# EAGLE design mainboard_v2.1 (EAGLE 6.3)
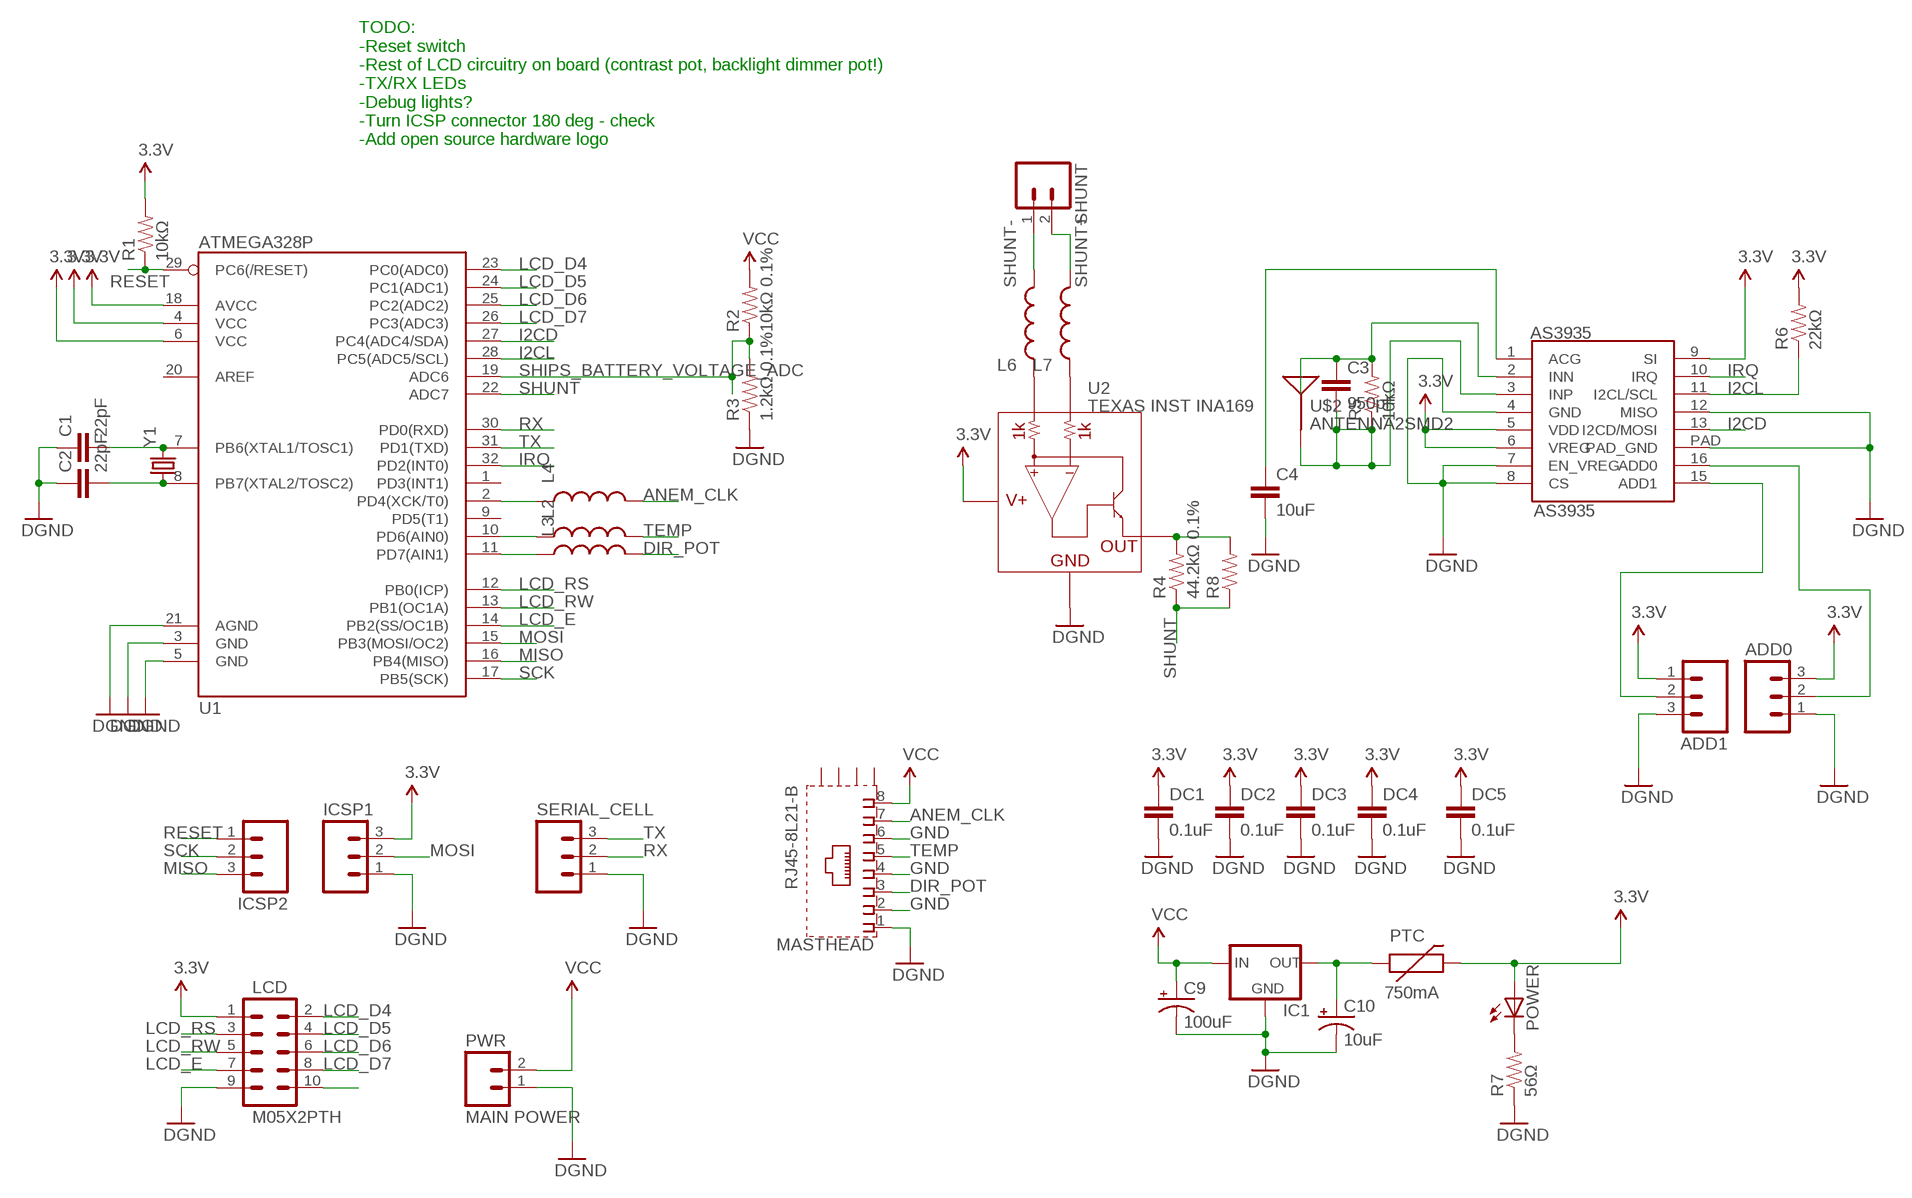
[diagram p0: schematic, sheet 1]

## Parts
ADD0  M03LOCK  [1X03_LOCK]
ADD1  M03LOCK  [1X03_LOCK]
AS3935  AS3935  [16LDMLPQ]
C1  22pF  CAP0805  [0805]
C2  22pF  CAP0805  [0805]
C3  950pF  CAP0805  [0805]
C4  10uF  CAP0805  [0805]
C9  100uF  CAP_POLPTH4  [CPOL-RADIAL-1000UF-25V]
C10  10uF  CAP_POLPTH2  [CPOL-RADIAL-10UF-25V]
DC1  0.1uF  CAP0805  [0805]
DC2  0.1uF  CAP0805  [0805]
DC3  0.1uF  CAP0805  [0805]
DC4  0.1uF  CAP0805  [0805]
DC5  0.1uF  CAP0805  [0805]
IC1  V_REG_78XXSINK  [TO220-IGO]
ICSP1  M03PTH  [1X03]
ICSP2  M03PTH  [1X03]
L2  INDUCTOR0805  [0805]
L3  INDUCTOR0805  [0805]
L4  INDUCTOR0805  [0805]
L6  INDUCTOR0805  [0805]
L7  INDUCTOR0805  [0805]
LCD  M05X2PTH  [AVR_ICSP]
MASTHEAD  RJ45-8L21-B  [RJ45-SHIELD1]
POWER  LED1206  [LED-1206]
PTC  750mA  PTCSMD  [PTC-1206]
PWR  MAIN POWER  M02-JST-2-PTH-NO_SILK  [JST-2-PTH-NS]
R1  10kΩ  RESISTOR0805-RES  [0805]
R2  10kΩ 0.1%  RESISTOR0805-RES  [0805]
R3  1.2kΩ 0.1%  RESISTOR0805-RES  [0805]
R4  44.2kΩ 0.1%  RESISTOR0805-RES  [0805]
R5  10kΩ  RESISTOR0805-RES  [0805]
R6  22kΩ  RESISTOR0805-RES  [0805]
R7  56Ω  RESISTOR0805-RES  [0805]
R8  RESISTOR0402-RES  [0402-RES]
SERIAL_CELL  M03LOCK  [1X03_LOCK]
SHUNT  M02LOCK  [1X02_LOCK]
U1  ATMEGA328P  ATMEGA328_SMT  [TQFP32-08]
U2  TEXAS INST INA169  INA139  [SOT23-5]
U$2  ANTENNA2SMD2  [ANTENNA-CHIP3]
Y1  CRYSTALTXC-7A  [CRYSTAL-TXC-7A]

## Nets
3.3V: ADD0.3 ADD1.1 AS3935.5(VDD) AS3935.6(VREG) AS3935.9(SI) DC1.1 DC2.1 DC3.1 DC4.1 DC5.1 ICSP1.3 LCD.1 POWER.A PTC.2 R1.2 R6.2 U1.4(VCC) U1.6(VCC) U1.18(AVCC) U2.5(V+)
ADD0: ADD0.2 AS3935.16(ADD0)
ADD1: ADD1.2 AS3935.15(ADD1)
ANEM_CLK: L4.2 MASTHEAD.7
AS3935_INN: AS3935.2(INN) C3.1 R5.2
AS3935_INP: AS3935.3(INP) C3.2 R5.1 U$2.FEED(SIGNAL)
DIR_POT: L3.2 MASTHEAD.3
GND: ADD0.1 ADD1.3 AS3935.4(GND) AS3935.7(EN_VREG) AS3935.8(CS) AS3935.12(MISO) AS3935.PAD(PAD_GND) C1.1 C2.1 C4.2 C9.2(-) C10.2(-) DC1.2 DC2.2 DC3.2 DC4.2 DC5.2 IC1.GND ICSP1.1 LCD.9 MASTHEAD.1 MASTHEAD.2 MASTHEAD.4 MASTHEAD.6 PWR.1 R3.1 R7.1 SERIAL_CELL.1 U1.3(GND) U1.5(GND) U1.21(AGND) U2.2(GND) ; supply symbol labelled DGND
I2CD: AS3935.13(I2CD/MOSI) U1.27(PC4(ADC4/SDA))
I2CL: AS3935.11(I2CL/SCL) R6.1 U1.28(PC5(ADC5/SCL))
IRQ: AS3935.10(IRQ) U1.32(PD2(INT0))
LCD_D4: LCD.2 U1.23(PC0(ADC0))
LCD_D5: LCD.4 U1.24(PC1(ADC1))
LCD_D6: LCD.6 U1.25(PC2(ADC2))
LCD_D7: LCD.8 U1.26(PC3(ADC3))
LCD_E: LCD.7 U1.14(PB2(SS/OC1B))
LCD_RS: LCD.3 U1.12(PB0(ICP))
LCD_RW: LCD.5 U1.13(PB1(OC1A))
MISO: ICSP2.3 U1.16(PB4(MISO))
MOSI: ICSP1.2 U1.15(PB3(MOSI/OC2))
N$6: AS3935.1(ACG) C4.1
N$7: L3.1 U1.11(PD7(AIN1))
N$8: L2.1 U1.10(PD6(AIN0))
N$9: L4.1 U1.2(PD4(XCK/T0))
N$10: L6.1 U2.3(VIN+)
N$11: L7.1 U2.4(VIN-)
N$12: R4.2 R8.2 U2.1(OUT)
N$13: LCD.10
N$16: POWER.C R7.2
RESET: ICSP2.1 R1.1 U1.29(PC6(/RESET))
RX: SERIAL_CELL.2 U1.30(PD0(RXD))
SCK: ICSP2.2 U1.17(PB5(SCK))
SHIPS_BATTERY_VOLTAGE_ADC: R2.1 R3.2 U1.19(ADC6)
SHUNT: R4.1 R8.1 U1.22(ADC7)
SHUNT+: L7.2 SHUNT.2
SHUNT-: L6.2 SHUNT.1
TEMP: L2.2 MASTHEAD.5
TX: SERIAL_CELL.3 U1.31(PD1(TXD))
VCC: C9.1(+) IC1.IN MASTHEAD.8 PWR.2 R2.2
VREG_OUT: C10.1(+) IC1.OUT PTC.1
XTAL1: C1.2 U1.7(PB6(XTAL1/TOSC1)) Y1.P$2
XTAL2: C2.2 U1.8(PB7(XTAL2/TOSC2)) Y1.P$1
Unconnected: MASTHEAD.S1(S) MASTHEAD.S2(S) MASTHEAD.S3(S) MASTHEAD.S4(S) U1.1(PD3(INT1)) U1.9(PD5(T1)) U1.20(AREF)

## Notes on the sheet
- TODO:
  -Reset switch
  -Rest of LCD circuitry on board (contrast pot, backlight dimmer pot!)
  -TX/RX LEDs
  -Debug lights?
  -Turn ICSP connector 180 deg - check
  -Add open source hardware logo

## Library data of the parts
ADD0 ADD1 ICSP1 ICSP2 SERIAL_CELL = SparkFun-Connectors:M03: Header 3 Standard 3-pin 0.1" header. Use with straight break away headers (SKU : PRT-00116), right angle break away headers (PRT-00553), swiss pins (PRT-00743), machine pins (PRT-00117), and female headers (PRT-00115). Molex polarized connector foot print use with SKU : PRT-08232 with associated crimp pins and housings.
AS3935 = buds-parts:AS3935
C1-C4 DC1-DC5 = SparkFun-Capacitors:CAP: Capacitor Standard 0603 ceramic capacitor, and 0.1" leaded capacitor.
C9 C10 = SparkFun-Capacitors:CAP_POL: Capacitor Polarized These are standard SMD and PTH capacitors. Normally 10uF, 47uF, and 100uF in electrolytic and tantalum varieties. Always verify the external diameter of the through hole cap, it varies with capacity, voltage, and manufacturer. The EIA devices should be standard.
IC1 = SparkFun-PowerIC:V_REG_78XX: Voltage Regulator Standard 7805 5V regulator. IGO (Input Ground Output). Spark Fun Electronics SKU : COM-00107
L2-L4 L6 L7 = SparkFun-Passives:INDUCTOR: Inductors Basic Inductor/Choke - 0603 and 1206. Footprints are not proven and vary greatly between part numbers.
LCD = SparkFun-Connectors:M05X2: Header 5x2 Standard 10-pin dual row 0.1" header. Commonly used with AVR-ISP. Use with Spark Fun Electronics SKU: PRT-00778
MASTHEAD = con-tycoelectronics:RJ45*2: RJ45 Low Profile Shield Type 2 For all RJ45 L, LC, LCT and X Series Models Source: www.tycoelectronics.com .. ENG_DS_1654001_1099_RJ_L_0507.pdf; OC_FARNELL: unknown; OC_NEWARK: unknown
POWER = SparkFun-LED:LED: LEDs Standard schematic elements and footprints for 5mm, 3mm, 1206, and 0603 sized LEDs. 5mm - Spark Fun Electronics SKU : COM-00529 (and others)
PTC = SparkFun-PowerIC:PTC: Resettable Fuse PTC Resettable Fuse. Spark Fun Electronics SKU : COM-08357
PWR SHUNT = SparkFun-Connectors:M02: Header 2 Standard 2-pin 0.1" header. Use with straight break away headers (SKU : PRT-00116), right angle break away headers (PRT-00553), swiss pins (PRT-00743), machine pins (PRT-00117), and female headers (PRT-00115). Molex polarized connector foot print use with SKU : PRT-08233 with associated crimp pins and housings.
R1-R8 = SparkFun-Resistors:RESISTOR: Resistor Basic schematic elements and footprints for 0603, 1206, and PTH resistors.
U1 = SparkFun-DigitalIC:ATMEGA328_SMT: 32-Pin Atmega328 part Commonly used on Arduino compatible boards Available in QFP and QFN packages TQFP is IC-09069 QFN is non-stock; PROD_ID: IC-09069
U2 = SparkFun-AnalogIC:INA139: High-side shunt current sense 2.7V-40V, 1%
U$2 = SparkFun-RF:ANTENNA2: Chip antenna Single endded antenna. Common with smaller chip antennas. CHIP4 package is the GPS Chip Antenna SKU: GPS-08418. CHIP5 package is 2.4GHz chip antenna SKU: WRL-00144.
Y1 = SparkFun-FreqCtrl:CRYSTAL: Various standard crystals. Proven footprints. Spark Fun Electronics SKU : COM-00534

## Board
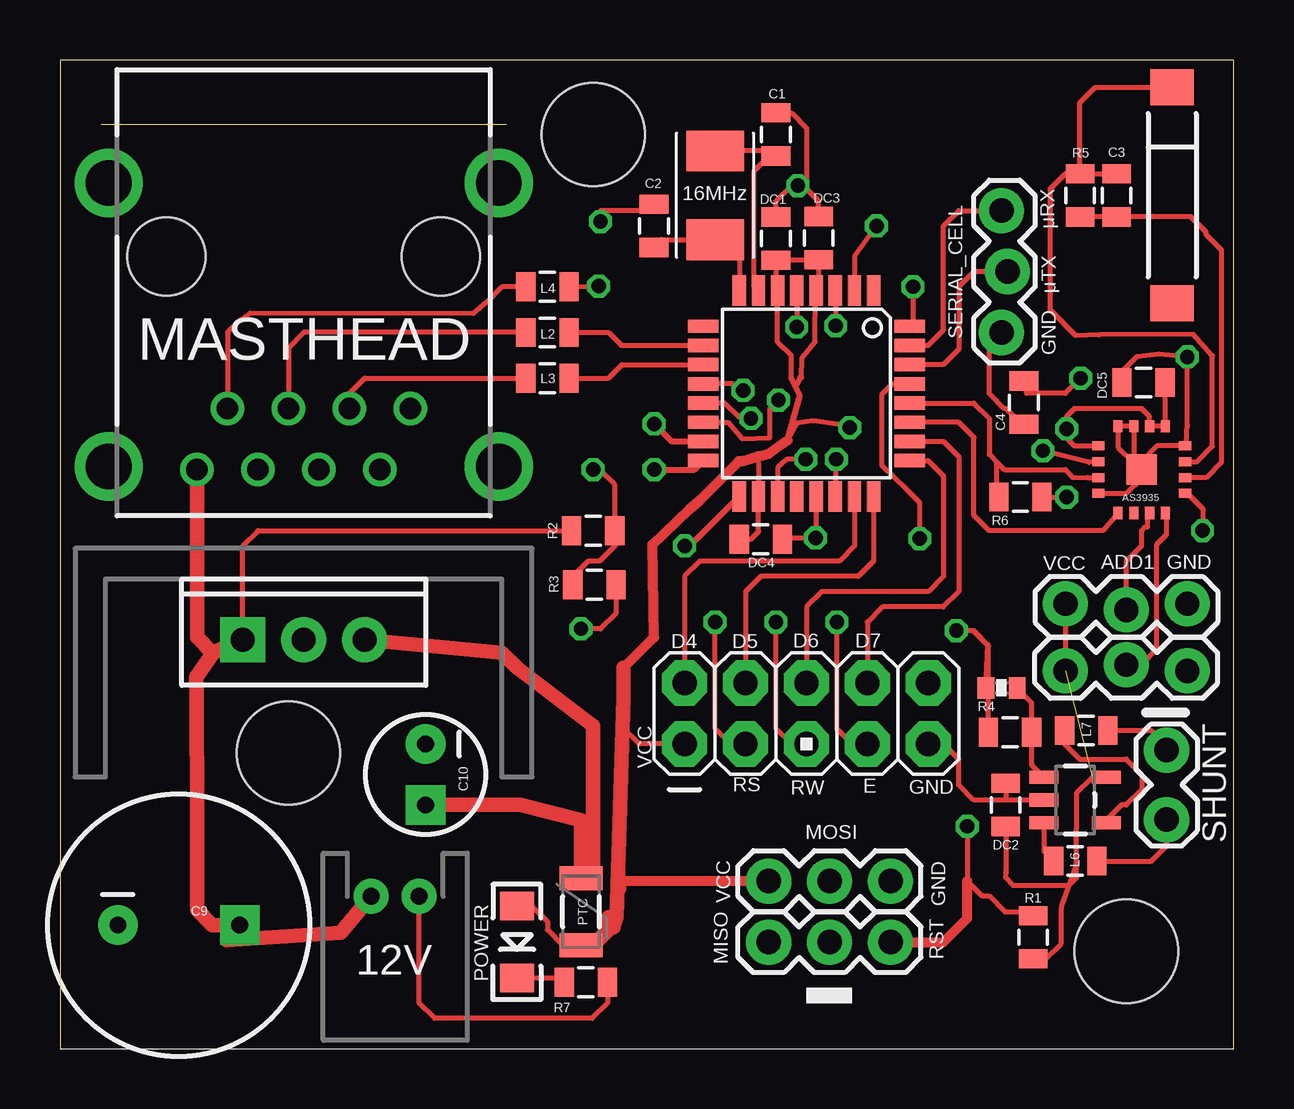
[diagram p1: board, top side]
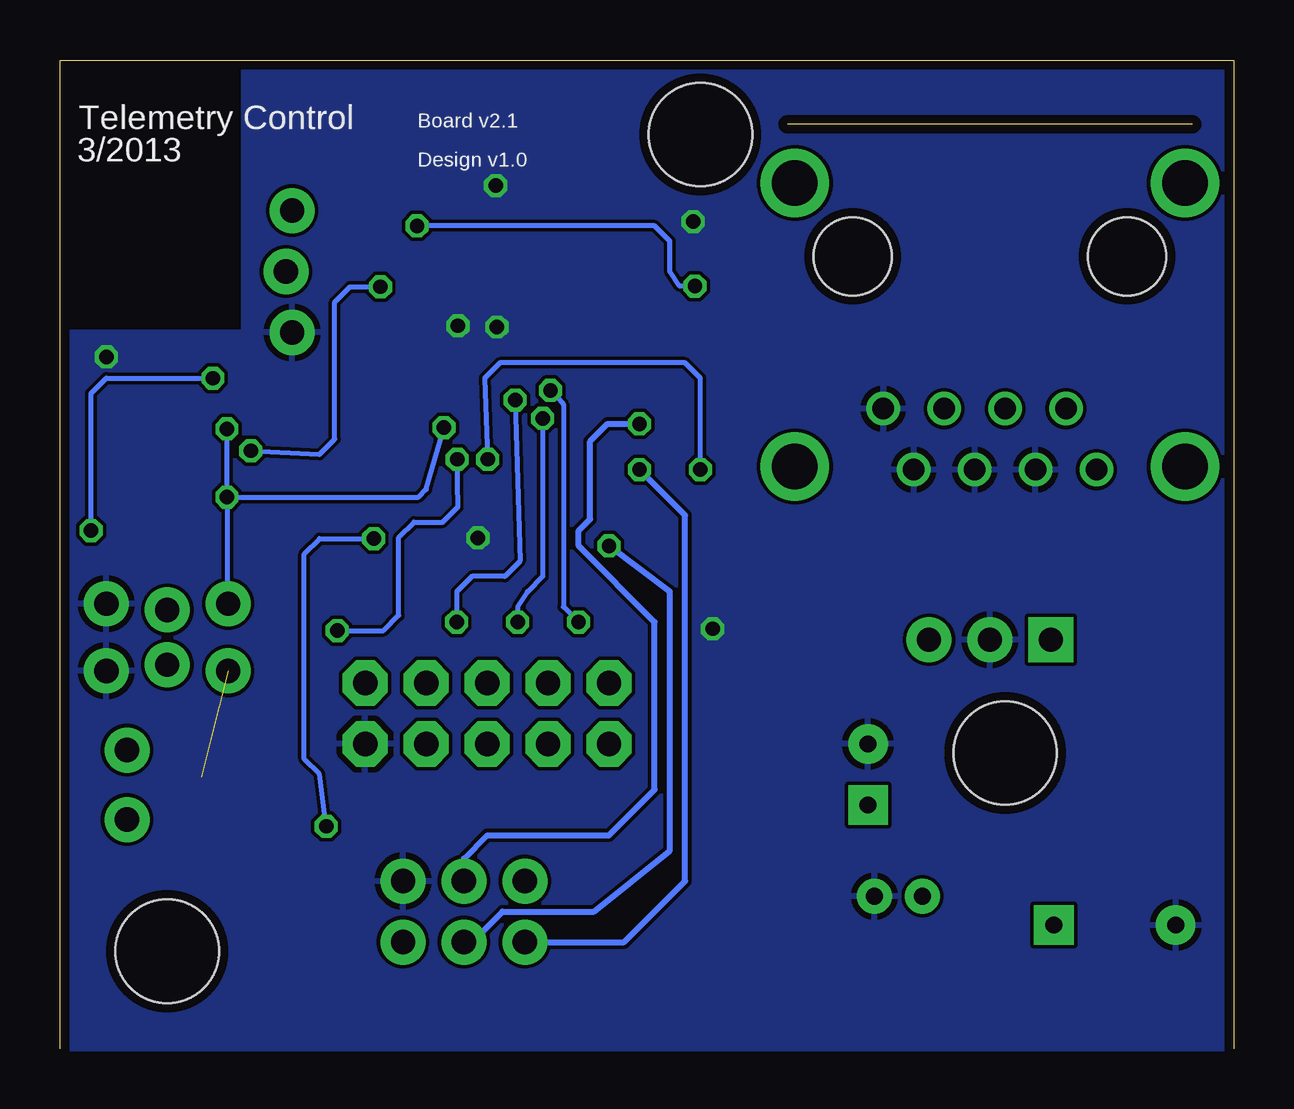
[diagram p2: board, bottom side, seen from below]

Size 48.92 x 41.2 mm. Coordinates in mm from the lower left corner, seen from the top.
Outline: 48.92,0 48.92,41.2 0,41.2 0,0
Copper layers (1*16): Top 0.0356mm / dielectric 1.5011mm / Bottom 0.0356mm
Design rules "oshpark *": minimum track width 6mil, minimum drill 13mil, track to track 6mil, track to pad 6mil, pad to pad 6mil, via to via 6mil, smd to smd 6mil, copper to edge 15mil, drill to drill 6mil, minimum pad ring 7mil, minimum via ring 7mil, stop-mask expansion 4mil, vias tented up to drill 25mil, thermal gap 10mil
Holes 4.31 mm at 22.23,38.1 44.45,4.06 9.53,12.32

### Footprints (pad centres in the part's own frame; a part is rotated, then mirrored left to right if it is on the bottom)
1X03_LOCK = drill 1.016 pad 1.88: 1 0,0.127; 2 2.54,-0.127; 3 5.08,0.127
16LDMLPQ = smd 0.508 x 0.381: 1 -1.81,0.991; 2 -1.81,0.33; 3 -1.81,-0.33; 4 -1.81,-0.991; 9 1.81,-0.991; 10 1.81,-0.33; 11 1.81,0.33; 12 1.81,0.991 | smd 0.381 x 0.508: 5 -0.991,-1.81; 6 -0.33,-1.81; 7 0.33,-1.81; 8 0.991,-1.81; 13 0.991,1.81; 14 0.33,1.81; 15 -0.33,1.81; 16 -0.991,1.81 | smd 1.27 x 1.27: PAD 0,0
0805 = smd 0.8 x 1.2: 1 -0.9,0; 2 0.9,0
CPOL-RADIAL-1000UF-25V = drill 0.7 pad 1.651 square: 1 2.54,0 | drill 0.7 pad 1.651: 2 -2.54,0
CPOL-RADIAL-10UF-25V = drill 0.7 pad 1.651 square: 1 1.27,0 | drill 0.7 pad 1.651: 2 -1.27,0
TO220-IGO = drill 1 pad 1.88: GND 0,0; OUT 2.54,0 | drill 1 pad 1.88 square: IN -2.54,0
1X03 = drill 1.016 pad 1.88: 1 0,0; 2 2.54,0; 3 5.08,0
AVR_ICSP = drill 1.016 pad 1.88 octagon: 1 -1.27,5.08; 2 1.27,5.08; 3 -1.27,2.54; 4 1.27,2.54; 5 -1.27,0; 6 1.27,0; 7 -1.27,-2.54; 8 1.27,-2.54; 9 -1.27,-5.08; 10 1.27,-5.08
RJ45-SHIELD1 = drill 0.9 pad 1.4: 1 -4.445,6.35; 2 -3.175,8.89; 3 -1.905,6.35; 4 -0.635,8.89; 5 0.635,6.35; 6 1.905,8.89; 7 3.175,6.35; 8 4.445,8.89 | drill 1.9 pad 2.5: S1 -8.128,-3.048; S2 8.128,-3.048; S3 -8.128,8.76; S4 8.128,8.76 | hole 3.251: -5.715,0; 5.715,0
LED-1206 = smd 1.2 x 1.4: A -1.5,0; C 1.5,0
PTC-1206 = smd 1 x 1.8: 1 -1.4,0; 2 1.4,0
JST-2-PTH-NS = drill 0.7 pad 1.448: 1 -1,0; 2 1,0
0402-RES = smd 0.7 x 0.9: 1 -0.65,0; 2 0.65,0
1X02_LOCK = drill 1.016 pad 1.88: 1 -0.178,0; 2 2.718,0
TQFP32-08 = smd 1.27 x 0.559: 1 -4.293,2.8; 2 -4.293,2; 3 -4.293,1.2; 4 -4.293,0.4; 5 -4.293,-0.4; 6 -4.293,-1.2; 7 -4.293,-2; 8 -4.293,-2.8; 17 4.293,-2.8; 18 4.293,-2; 19 4.293,-1.2; 20 4.293,-0.4; 21 4.293,0.4; 22 4.293,1.2; 23 4.293,2; 24 4.293,2.8 | smd 0.559 x 1.27: 9 -2.8,-4.293; 10 -2,-4.293; 11 -1.2,-4.293; 12 -0.4,-4.293; 13 0.4,-4.293; 14 1.2,-4.293; 15 2,-4.293; 16 2.8,-4.293; 25 2.8,4.293; 26 2,4.293; 27 1.2,4.293; 28 0.4,4.293; 29 -0.4,4.293; 30 -1.2,4.293; 31 -2,4.293; 32 -2.8,4.293
SOT23-5 = smd 0.55 x 1.2: 1 -0.95,-1.3; 2 0,-1.3; 3 0.95,-1.3; 4 0.95,1.3; 5 -0.95,1.3
ANTENNA-CHIP3 = smd 1.8 x 1.5: FEED 0,4.5; NC 0,-4.5
CRYSTAL-TXC-7A = smd 1.7 x 2.4: P$1 1.85,0; P$2 -1.85,0

### Placement (x,y rotation side)
ADD0  46.99,15.88 180 top
ADD1  41.91,18.41 0 top
AS3935  45.09,24.13 180 top
C1  29.84,38.1 270 top
C2  24.77,34.29 270 top
C3  44.04,35.56 90 top
C4  40.18,26.92 270 top
C9  4.95,5.16 0 top
C10  15.24,11.43 270 top
DC1  29.84,33.76 90 top
DC2  39.42,10.16 90 top
DC3  31.62,33.78 90 top
DC4  29.21,21.23 0 top
DC5  45.16,27.76 180 top
IC1  10.16,17.04 0 top
ICSP1  34.62,6.99 180 top
ICSP2  34.62,4.45 180 top
L2  20.32,29.84 180 top
L3  20.32,27.94 180 top
L4  20.32,31.75 180 top
L6  42.32,7.82 0 top
L7  42.77,13.26 0 top
LCD  31.11,13.97 90 top
MASTHEAD  10.16,33.02 180 top
POWER  19.05,4.45 270 top
PTC  21.72,5.71 270 top
PWR  13.97,6.35 180 top
R1  40.56,4.65 270 top
R2  22.23,21.59 180 top
R3  22.28,19.33 180 top
R4  39.6,13.18 0 top
R5  42.52,35.56 270 top
R6  40.03,22.99 0 top
R7  21.92,2.77 180 top
R8  39.24,15.04 0 top
SERIAL_CELL  39.37,29.84 90 top
SHUNT  46.13,9.73 90 top
U1  31.11,27.3 270 top
U2  42.32,10.36 270 top
U$2  46.35,35.56 0 top
Y1  27.3,35.56 270 top

### Tracks (layer width: path | path; a pad name or v marks a point on that pad's centre or on a via)
3.3V  (via drill 0.6)  (1 unrouted)
  Top 0.203: U1.4 31.62,31.71 DC3.1 29.87,32.88 DC1.1 29.84,31.67 U1.6 29.91,29.45 30.48,28.88 30.48,27.94 | DC5.1 46.06,25.95 | 46.06,25.95 AS3935.5 | 29.1,24.69 29.11,24.17 U1.18 29.11,21.55 28.8,21.23 DC4.1 | R6.2 v41.96,22.99 | v32.92,25.88 32.99,25.93 31.39,26.16 30.71,26.06 30.33,25.35 | ADD1.1 ADD0.3 | AS3935.9 42.28,25.12 41.96,25.44 v41.96,25.83 41.96,26.35 42.28,26.67 45.1,26.67 45.41,26.35 AS3935.6 46.05,25.94 46.06,25.95 | POWER.A 19.68,5.95 20.32,5.31 20.32,4.95 20.95,4.32 PTC.2 | 39.42,8.62 DC2.1 39.42,7.36 39.41,7.14 39.73,6.81 42.05,6.81 42.37,7.12 42.37,7.62 | 42.37,7.62 42.39,10.68 43.03,11.31 U2.5 | 23.39,6.63 23.29,6.3 23.24,6.12 23.19,5.49 | LCD.1 24.13,12.7 23.5,13.34 23.5,14.61 | R1.2 41.1,3.75 41.74,4.38 41.74,5.79 41.78,6.01 42.37,7.62
  Top 0.254: 30.33,25.35 30.84,27.2 30.48,27.94
  Top 0.406: 23.5,15.88 24.77,17.14 24.69,21.01 26.24,22.48 26.67,22.86 28.3,24.49 28.42,24.49 | 28.42,24.49 29.54,24.79 30.33,25.35 | 28.42,24.49 29.1,24.69 | ICSP1.3 23.39,6.99 23.39,6.63
  Top 0.61: 23.5,15.88 23.5,14.61 23.19,5.49 23.06,5.05 22.86,5.49 22.86,4.95 22.23,4.32 PTC.2
  Bottom 0.203: v41.96,22.99 33.97,22.99 33.66,23.3 v32.92,25.88 | v41.96,22.99 41.96,18.59 ADD1.1 | v41.96,22.99 v41.96,25.83
ADD0
  Top 0.203: ADD0.2 45.09,16 45.72,16.64 45.72,21.03 46.13,21.44 46.13,22.27 AS3935.16
ADD1
  Top 0.203: ADD1.2 44.45,20.32 45.09,20.95 45.09,21.59 45.24,21.74 45.34,21.74 45.34,22.24 AS3935.15
ANEM_CLK
  Top 0.203: L4.2 18.41,31.75 17.78,31.11 17.22,30.63 7.92,30.66 7.46,30.32 6.99,29.84 MASTHEAD.7
AS3935_INN
  Top 0.203: AS3935.2 47.78,23.8 48.41,24.43 48.41,33.28 47.78,33.92 47.78,34.02 47.14,34.66 C3.1 R5.2
AS3935_INP
  Top 0.203: AS3935.3 47.4,24.46 48.03,25.09 48.03,28.88 47.24,29.77 43.31,29.74 42.34,29.72 41.27,30.79 41.27,35.83 41.91,36.46 R5.1 | R5.1 C3.2 | R5.1 42.52,39.42 43.16,40.06 U$2.FEED
DIR_POT
  Top 0.203: MASTHEAD.3 12.06,27.3 12.7,27.94 L3.2
GND  (via drill 0.6)
  Top 0.203: C2.1 24.77,35.24 | DC1.2 29.84,35.33 30.48,35.97 v30.76,35.97 30.99,35.97 31.11,35.84 | DC3.2 31.62,35.33 31.11,35.84 | U1.5 v30.71,30.08 v30.71,30.07 | U1.3 32.31,30.14 v32.33,30.12 | U1.21 31.52,21.3 v31.5,21.29 30.16,21.29 DC4.2 | R3.1 23.18,18.14 22.54,17.5 v21.72,17.5 | R7.1 22.82,1.91 22.18,1.27 15.61,1.27 14.97,1.91 PWR.1 | U2.2 39.37,10.36 | 39.37,10.36 38.1,10.36 37.47,11 37.47,12.06 36.83,12.7 LCD.9 | DC2.2 39.42,10.41 39.37,10.36 | AS3935.PAD 45.09,24.49 45.72,25.12 AS3935.4 46.91,25.12 46.94,25.09 46.97,25.73 46.99,25.96 v46.99,28.83 46.86,28.85 45.82,28.96 44.9,28.85 44.26,28.22 DC5.2 | AS3935.12 44.45,23.14 45.09,23.77 AS3935.PAD | AS3935.PAD 44.76,24.46 AS3935.7 AS3935.8 44.09,25.07 44.73,24.43 44.93,24.43 | C1.1 30.48,39 31.11,38.37 31.11,35.84 | 24.77,35.33 24.77,35.24 | 24.77,35.24 24.45,34.92 22.54,34.92 22.23,34.61 22.23,34.29 22.35,34.29 v22.53,34.47 | C4.2 40.08,26.04 39.45,26.67 39.37,26.67 38.73,27.3 38.73,29.21 39.24,29.72 SERIAL_CELL.1
  pour Bottom: 41.27,41.27 41.27,29.84 48.9,29.84 48.9,0 0,0 0,41.27
I2CD
  Top 0.203: AS3935.13 43.46,21.59 38.73,21.59 38.1,22.23 38.1,25.47 37.47,26.11 U1.27
I2CL
  Top 0.203: AS3935.11 42.84,23.8 42.21,23.81 41.91,24.13 39.37,24.13 39.05,24.45 | U1.28 38.1,26.91 38.73,26.27 38.73,24.77 39.05,24.45 | R6.1 39.05,23.07 39.05,24.45
IRQ  (via drill 0.6)
  Top 0.203: AS3935.10 42.9,24.43 v40.97,24.92 | v35.56,31.75 35.56,30.26 U1.32
  Bottom 0.203: v40.97,24.92 38.1,24.77 37.47,25.4 37.47,31.11 36.83,31.75 v35.56,31.75
LCD_D4
  Top 0.203: U1.23 33.12,20.95 32.48,20.32 26.67,20.32 26.04,19.68 LCD.2
LCD_D5
  Top 0.203: LCD.4 28.57,19.05 29.21,19.68 33.28,19.68 33.91,20.32 U1.24
LCD_D6
  Top 0.203: U1.25 36.2,24.5 36.83,23.87 36.83,19.68 36.2,19.05 31.75,19.05 31.11,18.41 LCD.6
LCD_D7
  Top 0.203: LCD.8 33.66,17.78 34.29,18.41 36.83,18.41 37.47,19.05 37.47,24.67 36.83,25.3 U1.26
LCD_E  (via drill 0.6)
  Top 0.203: LCD.7 33.02,12.7 32.38,13.34 v32.38,17.78 | U1.14 27.84,26.11 28.42,25.42 29.59,25.45 29.59,26.67 v29.95,27.03
  Bottom 0.203: v29.95,27.03 29.74,20.32 30.38,19.68 31.75,19.68 32.38,19.05 v32.38,17.78
LCD_RS  (via drill 0.6)
  Top 0.203: LCD.3 27.94,12.7 27.3,13.34 v27.3,17.78 | v28.47,27.43 28.05,27.7 U1.12
  Bottom 0.203: v28.47,27.43 27.94,26.85 27.94,18.41 v27.3,17.78
LCD_RW  (via drill 0.6)
  Top 0.203: LCD.5 30.48,12.7 29.84,13.34 v29.84,17.78 | v28.8,26.26 28.3,26.31 27.7,26.91 U1.13
  Bottom 0.203: v28.8,26.26 28.8,19.68 29.44,19.05 29.84,18.41 v29.84,17.78
MISO  (via drill 0.6)
  Top 0.254: v24.77,24.13 26.45,24.13 U1.16
  Bottom 0.254: ICSP2.3 25.4,4.45 22.86,6.99 22.86,22.23 v24.77,24.13
MOSI  (via drill 0.6)
  Top 0.254: v24.77,26.04 25.5,25.3 U1.15
  Bottom 0.254: ICSP1.2 32.08,7.92 31.11,8.89 26.04,8.89 24.13,10.79 24.13,17.78 27.3,20.95 27.3,21.59 26.82,22.07 U1.15 26.09,26.04 v24.77,26.04
N$3
  Top 0.254: 30.73,27.71 30.86,27.96
N$5
  Top 0.203: 30.91,27.96 30.94,28.78 31.47,29.44 31.5,31.52
N$6  (via drill 0.6)
  Top 0.203: AS3935.1 46.99,23.14 47.62,22.5 v47.62,21.59 | v42.55,27.94 41.91,27.3 40.3,27.3 C4.1
  Bottom 0.203: v47.62,21.59 47.62,27.3 46.99,27.94 v42.55,27.94
N$7
  Top 0.203: L3.1 22.86,27.94 23.43,28.5 U1.11
N$8
  Top 0.203: L2.1 22.86,29.84 23.4,29.3 U1.10
N$9  (via drill 0.6)
  Top 0.203: L4.1 v22.45,31.77 | v34.04,34.29 33.12,33.02 U1.2
  Bottom 0.203: v22.45,31.77 23.09,31.77 23.5,32.38 23.5,33.66 24.13,34.29 v34.04,34.29
N$10
  Top 0.203: U2.3 41.02,8.22 L6.1
N$11
  Top 0.203: L7.1 41.87,12.7 42.51,12.06 44.45,12.06 45.09,11.43 45.09,10.79 44.45,10.16 44.25,10.16 43.62,9.53 U2.4
N$12
  Top 0.203: U2.1 40.5,11.83 R4.2 40.5,14.41 R8.2
N$16
  Top 0.203: R7.2 20.84,2.94 POWER.C
RESET  (via drill 0.6)
  Top 0.203: v35.84,21.26 35.84,22.76 35.31,23.29 34.27,24.28 34.27,27.28 34.69,27.7 U1.29 | R1.1 40.4,5.71 39.37,5.71 39.37,5.74 38.73,6.38 38.43,6.38 37.82,6.99 v37.82,9.27
  Top 0.406: ICSP2.1 36.83,4.45 37.82,5.44 37.82,6.99
  Bottom 0.203: v37.82,9.27 38.1,11.43 38.73,12.06 38.73,20.62 38.1,21.26 v35.84,21.26
RX
  Top 0.203: SERIAL_CELL.2 38.1,32.38 37.47,31.75 37.47,29.14 36.83,28.5 U1.30
SCK  (via drill 0.6)
  Top 0.254: v26.04,20.95 26.26,20.95 U1.17
  Bottom 0.254: ICSP2.2 31.75,4.45 30.48,5.71 26.67,5.71 23.5,8.26 23.5,19.05 v26.04,20.95
SHIPS_BATTERY_VOLTAGE_ADC  (via drill 0.6)
  Top 0.203: R3.2 21.38,19.68 22.01,20.32 22.49,20.32 23.12,20.95 R2.1 23.12,23.5 22.49,24.13 v22.23,24.13 | v31.09,24.56 30.3,24.56 29.91,24.21 U1.19
  Bottom 0.203: v22.23,24.13 22.23,27.94 22.86,28.57 30.58,28.57 31.22,27.94 v31.09,24.56
SHUNT  (via drill 0.6)
  Top 0.203: R4.1 38.7,16.79 38.06,17.42 v37.36,17.42 38.12,17.4 38.68,16.84 R8.1 | v32.36,24.56 32.31,24.42 U1.22
  Bottom 0.203: v37.36,17.42 35.43,17.42 34.8,18.06 34.8,21.31 34.16,21.95 32.97,21.95 32.33,22.58 v32.36,24.56
SHUNT+
  Top 0.203: SHUNT.2 46.13,12.62 45.49,13.26 L7.2
SHUNT-
  Top 0.203: L6.2 45.49,7.82 46.13,8.46 SHUNT.1
TEMP
  Top 0.203: L2.2 10.16,29.84 9.53,29.21 MASTHEAD.5
TX
  Top 0.203: U1.31 36.2,29.3 36.83,29.94 36.83,34.29 37.47,34.92 SERIAL_CELL.3
VCC
  Top 0.203: IC1.IN 7.62,20.95 8.26,21.59 R2.2
  Top 0.61: PWR.2 11.7,4.84 6.94,4.52 C9.1 6.35,5.16 5.71,5.79 5.71,9.53 5.69,14.88 5.68,15.48 6.39,16.49 IC1.IN 6.35,16.51 5.71,17.14 MASTHEAD.8
VREG_OUT
  Top 0.61: IC1.OUT 18.41,16.51 19.05,15.88 22.23,13.46 22.23,7.12 PTC.1 21.72,9.53 19.18,10.16 C10.1
XTAL1
  Top 0.203: U1.7 28.93,31.78 28.93,36.56 29.57,37.2 C1.2 29.64,37.41 Y1.P$2
XTAL2
  Top 0.203: C2.2 25.09,33.71 Y1.P$1 27.68,33.71 28.32,33.08 U1.8

### Text on the board
tPlace: VCC | GND | D4 | D5 | D6 | D7 | VCC | RS | RW | E | GND | MOSI | VCC | GND | MISO | RST | 12V
bPlace: Board v2.1 | Telemetry Control | Design v1.0 | 3/2013
tNames: 16MHz | μRX | μTX | GND